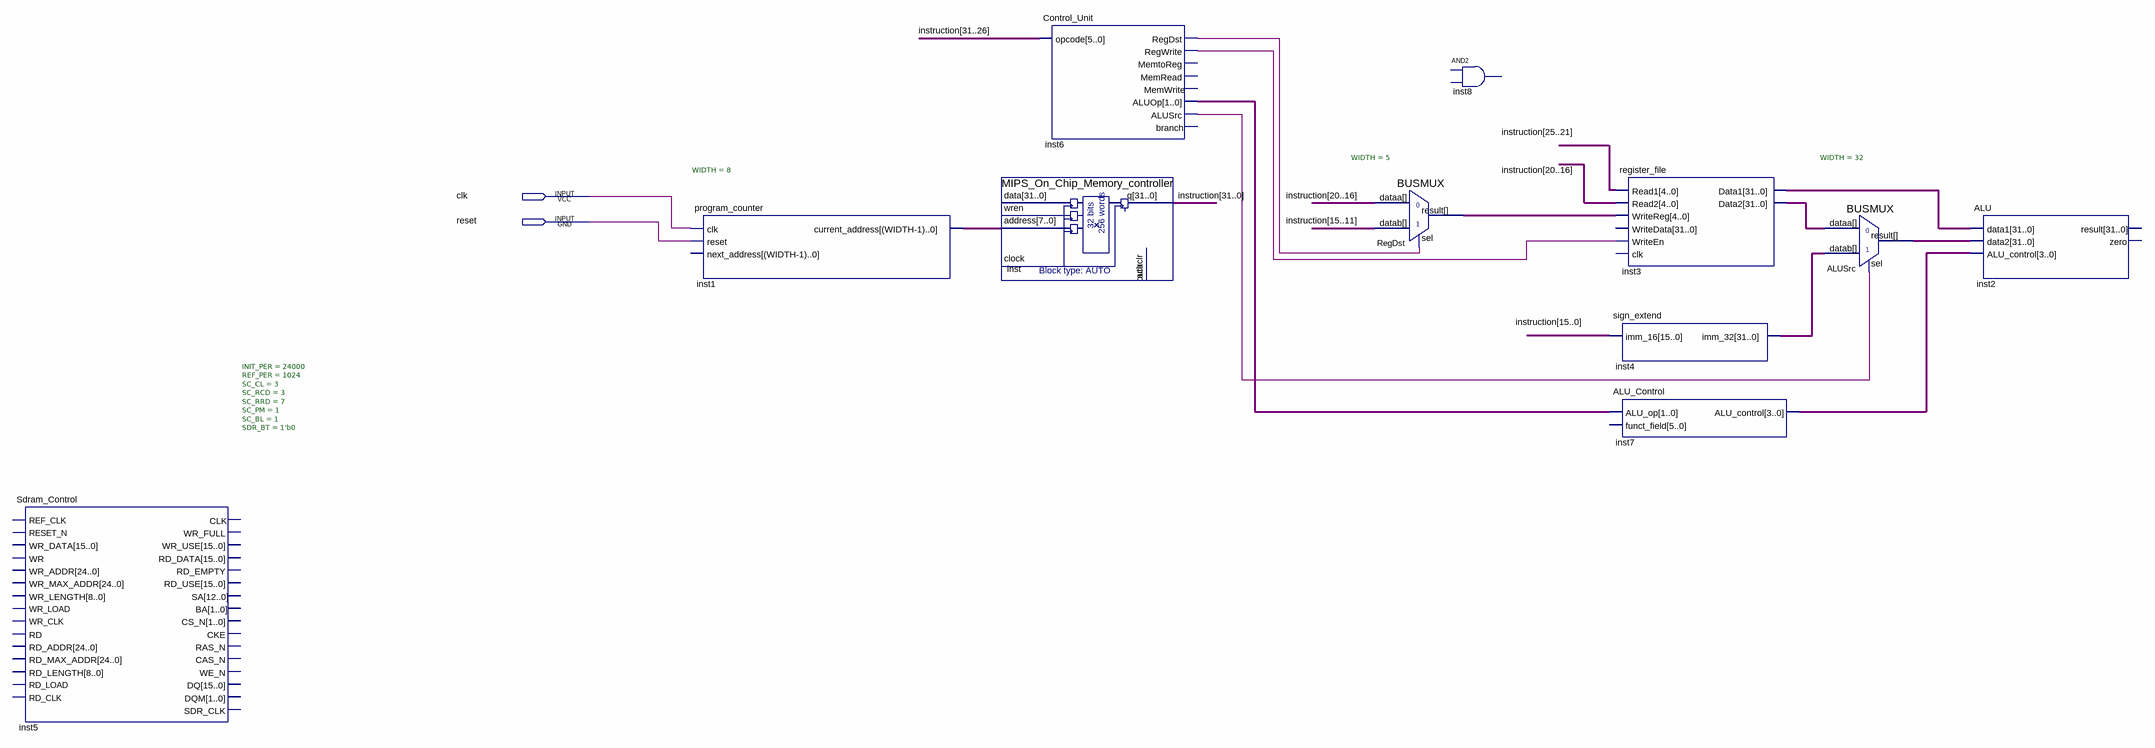
[diagram p0: schematic sheet]
// Quartus schematic CPU_schematic.bdf as structural Verilog: 11 symbols, 2 pins
module CPU_schematic (
  input  clk,
  input  reset
);

  wire inst6_alusrc, inst6_regdst, inst6_regwrite, undriven;
  wire [1:0] inst6_aluop;
  wire [3:0] inst7_alu_control;
  wire [4:0] RegDst_result;
  wire [7:0] inst1_current_address;
  wire [31:0] ALUSrc_result, inst3_data1, inst3_data2, inst4_imm_32, instruction;

  Sdram_Control #(.INIT_PER(24000), .REF_PER(1024), .SC_CL(3), .SC_RCD(3), .SC_RRD(7), .SC_PM(1), .SC_BL(1), .SDR_BT(1'b0)) inst5 ();  // open: REF_CLK, RESET_N, WR_DATA, WR, WR_ADDR, WR_MAX_ADDR, WR_LENGTH, WR_LOAD, WR_CLK, RD, RD_ADDR, RD_MAX_ADDR, RD_LENGTH, RD_LOAD, RD_CLK, CLK, WR_FULL, WR_USE, RD_DATA, RD_EMPTY, RD_USE, SA, BA, CS_N, CKE, RAS_N, CAS_N, WE_N, DQM, SDR_CLK, DQ
  program_counter #(.WIDTH(8)) inst1 (
    .clk(clk), .reset(reset), .current_address(inst1_current_address));  // open: next_address
  Control_Unit inst6 (
    .opcode(instruction[31:26]), .RegDst(inst6_regdst), .RegWrite(inst6_regwrite), .ALUOp(inst6_aluop),
    .ALUSrc(inst6_alusrc));  // open: MemtoReg, MemRead, MemWrite, branch
  MIPS_On_Chip_Memory_controller inst (
    .address(inst1_current_address), .aclr(undriven), .outaclr(undriven), .q(instruction));  // open: data, wren, clock
  BUSMUX #(.WIDTH(5)) RegDst (
    .datab(instruction[15:11]), .sel(inst6_regdst), .dataa(instruction[20:16]), .result(RegDst_result));
  // AND2 inst8 is placed but not wired
  register_file inst3 (
    .Read1(instruction[25:21]), .Read2(instruction[20:16]), .WriteReg(RegDst_result),
    .WriteEn(inst6_regwrite), .Data1(inst3_data1), .Data2(inst3_data2));  // open: WriteData, clk
  sign_extend inst4 (.imm_16(instruction[15:0]), .imm_32(inst4_imm_32));
  ALU_Control inst7 (.ALU_op(inst6_aluop), .ALU_control(inst7_alu_control));  // open: funct_field
  BUSMUX #(.WIDTH(32)) ALUSrc (.datab(inst4_imm_32), .sel(inst6_alusrc), .dataa(inst3_data2), .result(ALUSrc_result));
  ALU inst2 (.data1(inst3_data1), .data2(ALUSrc_result), .ALU_control(inst7_alu_control));  // open: result, zero
endmodule
